# EAGLE schematic Nodo_sensor_wa4_v1 (EAGLE 8.5.1)
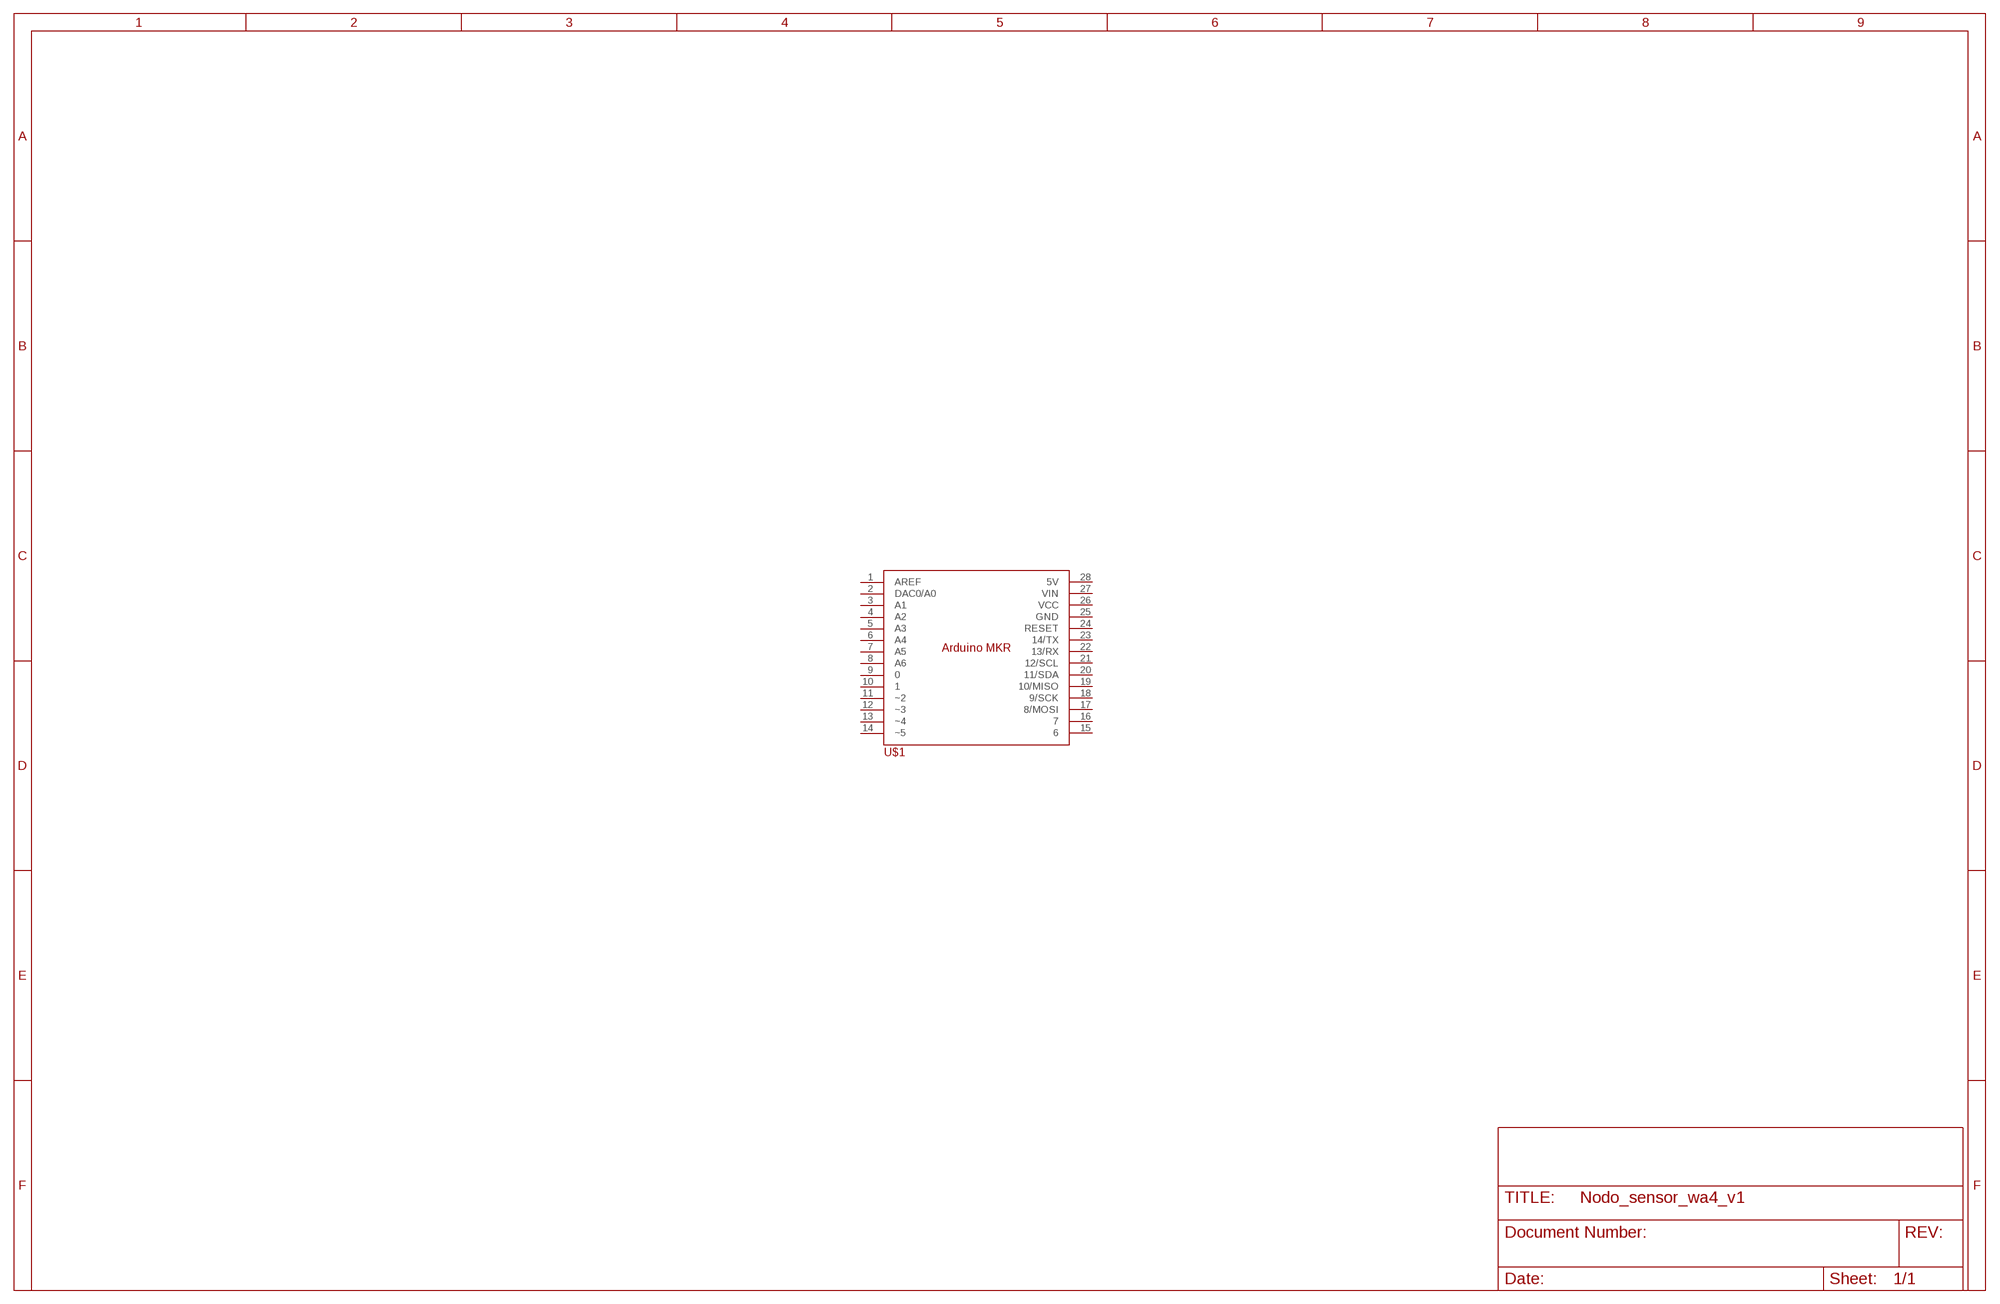
[diagram p0: schematic, sheet 1]

## Parts
U$1  ARDUINO_MKR  [ARDUINO_MKR]
Unconnected: U$1.1(AREF) U$1.2(DAC0/A0) U$1.3(A1) U$1.4(A2) U$1.5(A3) U$1.6(A4) U$1.7(A5) U$1.8(A6) U$1.9 U$1.10 U$1.11(~2) U$1.12(~3) U$1.13(~4) U$1.14(~5) U$1.15 U$1.16 U$1.17(8/MOSI) U$1.18(9/SCK) U$1.19(10/MISO) U$1.20(11/SDA) U$1.21(12/SCL) U$1.22(13/RX) U$1.23(14/TX) U$1.24(RESET) U$1.25(GND) U$1.26(VCC) U$1.27(VIN) U$1.28(5V)

## Library data of the parts
U$1 = Arduino_MKR:ARDUINO_MKR